# Altium schematic sheet [4] F2838 JTAG CLOCK SUP.SchDoc
size 431 x 279 mm; DocumentNumber: 5; SheetNumber: 5; SheetTotal: 9
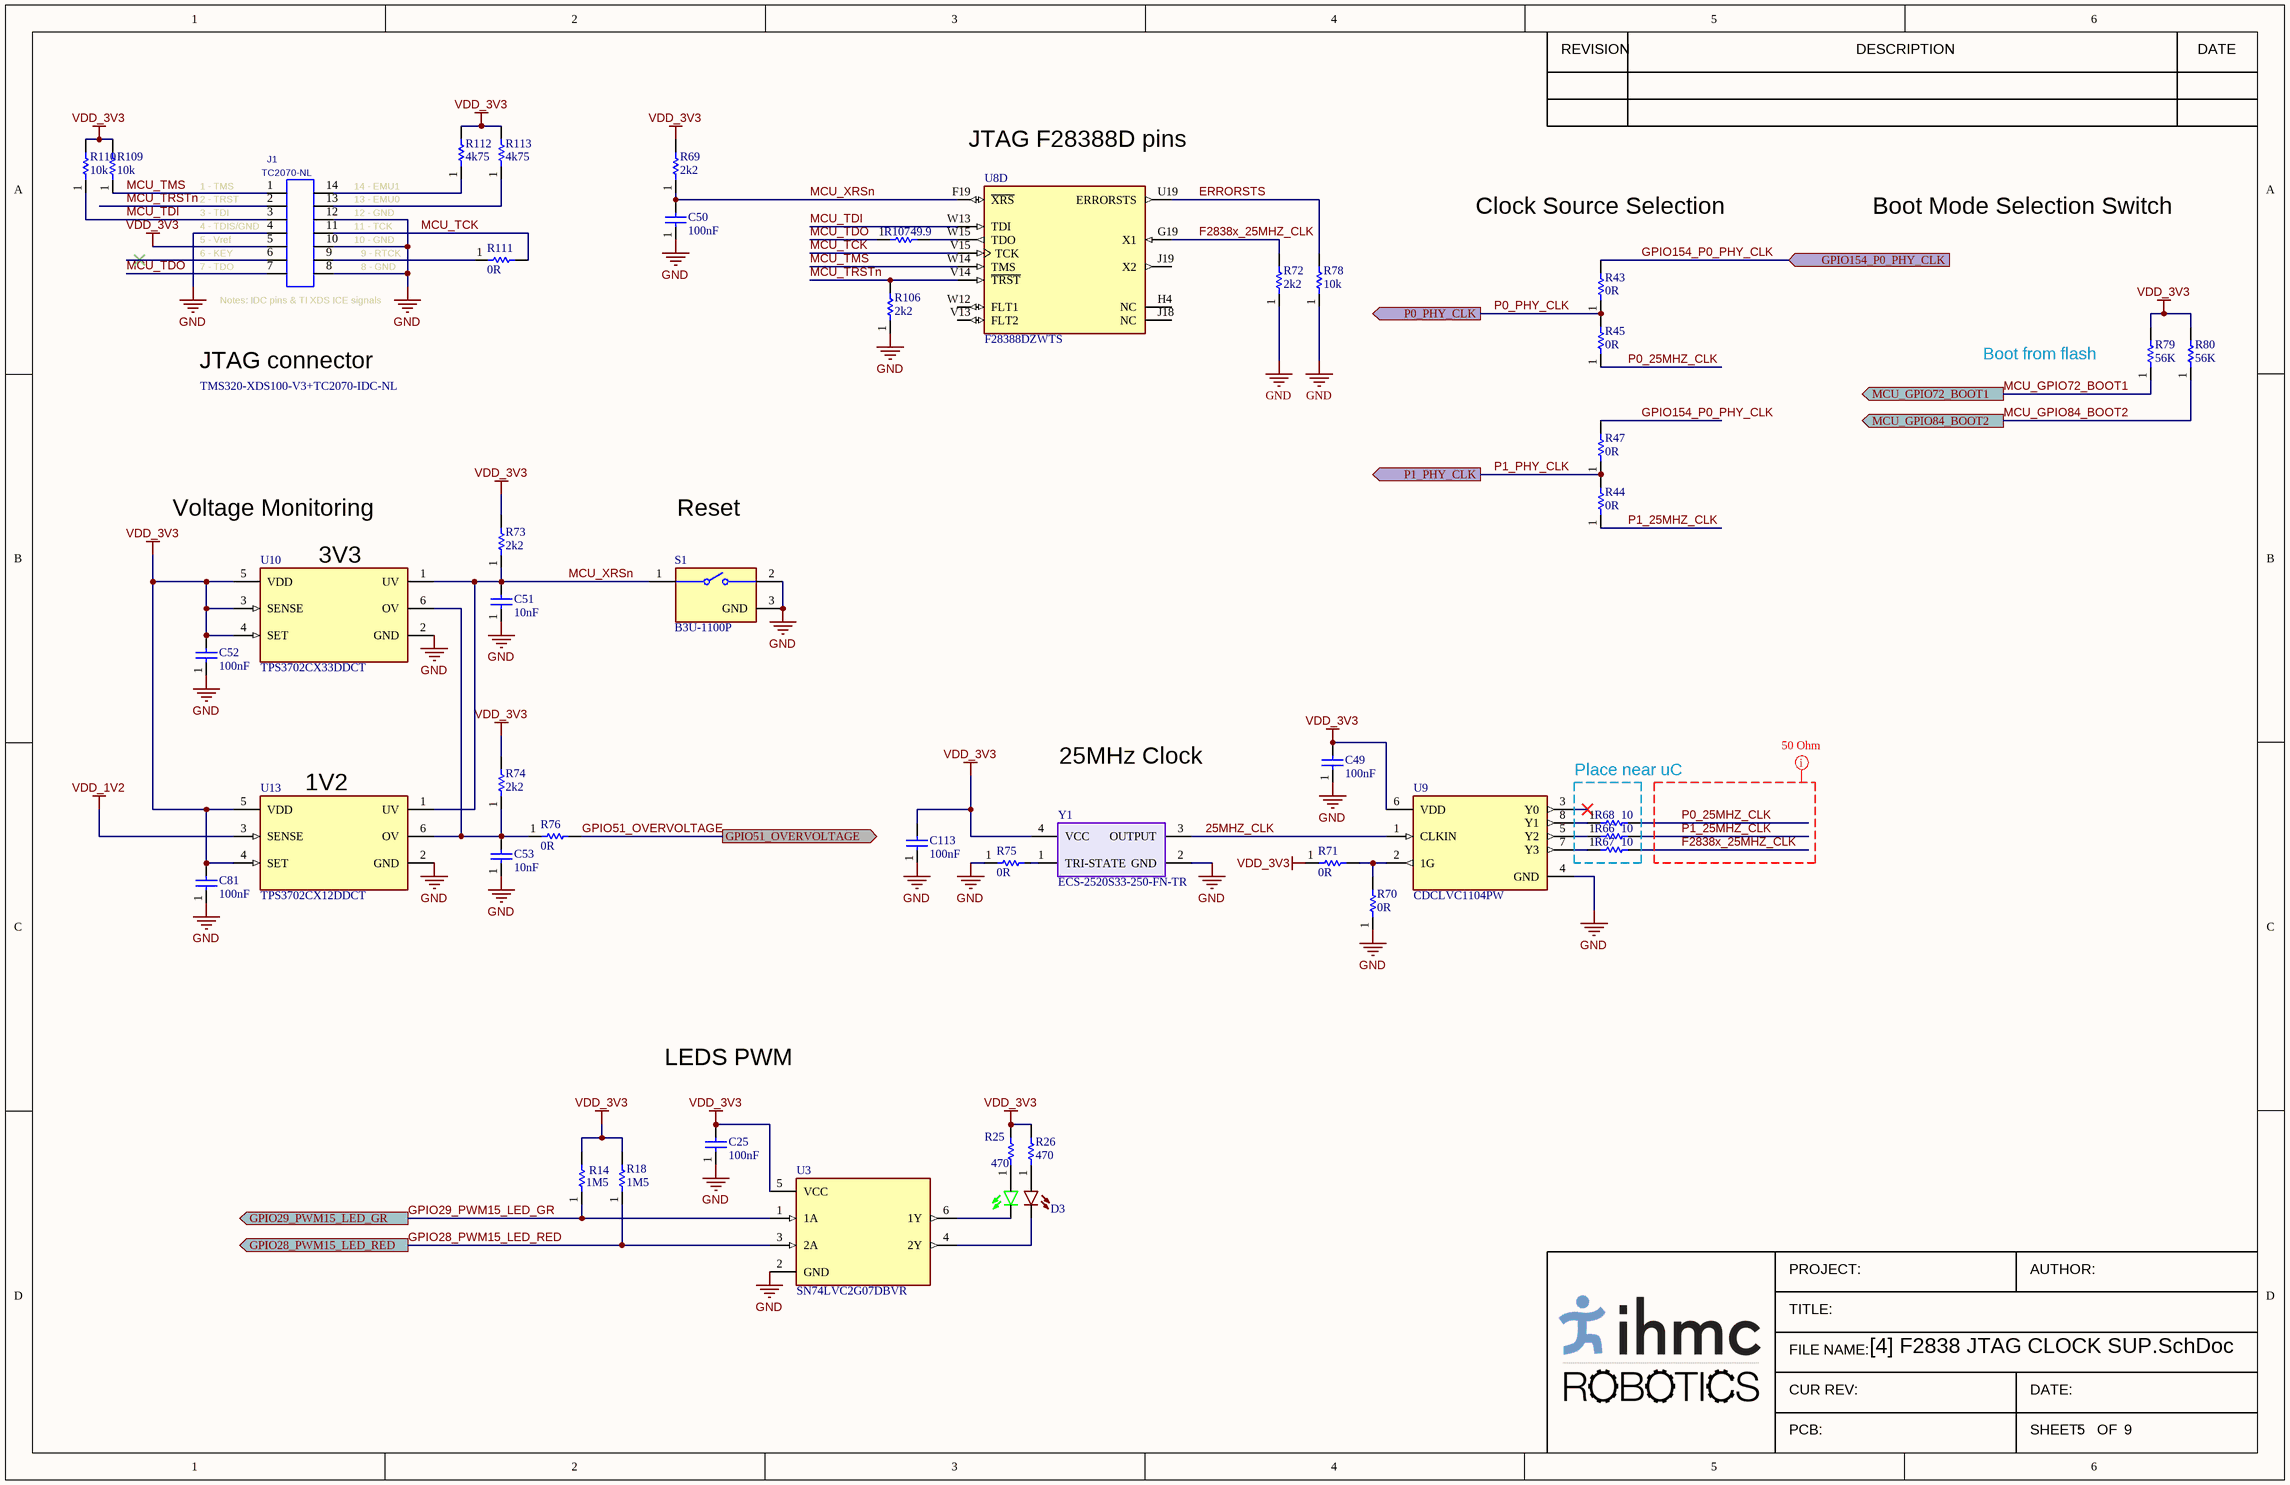
[diagram p0: [4] F2838 JTAG CLOCK SUP.SchDoc]

## Parts
C25  value 100nF  [CAPC1005X03N(0402)]  (hidden comment: GRM155R71C104JA88D)
C49  value 100nF  [CAPC1005X03N(0402)]  (hidden comment: GRM155R71C104JA88D)
C50  value 100nF  [CAPC1005X03N(0402)]  (hidden comment: GRM155R71C104JA88D)
C51  value 10nF  [CAPC1005X03N(0402)]  (hidden comment: CC0402KRX7R9BB103)
C52  value 100nF  [CAPC1005X03N(0402)]  (hidden comment: GRM155R71C104JA88D)
C53  value 10nF  [CAPC1005X03N(0402)]  (hidden comment: CC0402KRX7R9BB103)
C81  value 100nF  [CAPC1608X09N(0603)]  (hidden comment: CL10B104KB8NNNL)
C113  value 100nF  [CAPC1005X03N(0402)]  (hidden comment: GRM155R71C104JA88D)
D3  LTST-C195KGJRKT  [Dual_LED]  (value not drawn)
J1  TC2070-NL  [TC2070-NL]  (no BOM)
R14  value 1M5  [0402]  (hidden comment: CRCW04021M50JNED)
R18  value 1M5  [0402]  (hidden comment: CRCW04021M50JNED)
R25  value 470  [0402]  (hidden comment: CRCW0402470RJNED)
R26  value 470  [0402]  (hidden comment: CRCW0402470RJNED)
R43  value 0R  [0402]  (hidden comment: RCS04020000Z0ED)
R44  value 0R  [0402]  (hidden comment: RCS04020000Z0ED)
R45  value 0R  [0402]  (hidden comment: RCS04020000Z0ED)
R47  value 0R  [0402]  (hidden comment: RCS04020000Z0ED)
R66  value 10  [0402]  (hidden comment: ERA-2AKD100X)
R67  value 10  [0402]  (hidden comment: ERA-2AKD100X)
R68  value 10  [0402]  (hidden comment: ERA-2AKD100X)
R69  value 2k2  [0402]  (hidden comment: CRCW04022K20JNED)
R70  value 0R  [0402]  (hidden comment: RCS04020000Z0ED)
R71  value 0R  [0402]  (hidden comment: RCS04020000Z0ED)
R72  value 2k2  [0402]  (hidden comment: CRCW04022K20JNED)
R73  value 2k2  [0402]  (hidden comment: CRCW04022K20JNED)
R74  value 2k2  [0402]  (hidden comment: CRCW04022K20JNED)
R75  value 0R  [0402]  (hidden comment: RCS04020000Z0ED)
R76  value 0R  [0402]  (hidden comment: RCS04020000Z0ED)
R78  value 10k  [RESC1005X06N(0402)]  (hidden comment: RC0402FR-0710KL)
R79  value 56K  [0402]  (hidden comment: CRCW040256K0JNED)
R80  value 56K  [0402]  (hidden comment: CRCW040256K0JNED)
R106  value 2k2  [0402]  (hidden comment: CRCW04022K20JNED)
R107  value 49.9  [RESC1005X06N(0402)]  (hidden comment: CRCW040249R9FKED)
R109  value 10k  [RESC1005X06N(0402)]  (hidden comment: RC0402FR-0710KL)
R110  value 10k  [RESC1005X06N(0402)]  (hidden comment: RC0402FR-0710KL)
R111  value 0R  [0402]  (hidden comment: RCS04020000Z0ED)
R112  value 4k75  [RESC1005X06N(0402)]  (hidden comment: RC0402FR-074K75L)
R113  value 4k75  [RESC1005X06N(0402)]  (hidden comment: RC0402FR-074K75L)
S1  B3U-1100P  [FP-B3U-1100P-MFSWITCH_G]
U3  SN74LVC2G07DBVR  [DBV0006A_M]
U8  F28388DZWTS  [FP-ZWT0337A-IPC_B - ESNACK]  (part D of 8)
U9  CDCLVC1104PW  [FP-PW0008A-IPC_C-FIXONSHAPE]
U10  TPS3702CX33DDCT  [FP-DDC0006A-IPC_A]
U13  TPS3702CX12DDCT  [FP-DDC0006A-IPC_A]
Y1  ECS-2520S33-250-FN-TR  [XTAL_ECS-2520S]

## Ports
GPIO28_PWM15_LED_RED (out), GPIO29_PWM15_LED_GR (out), GPIO51_OVERVOLTAGE (out), GPIO154_P0_PHY_CLK (in), MCU_GPIO72_BOOT1 (out), MCU_GPIO84_BOOT2 (out), P0_PHY_CLK (out), P1_PHY_CLK (out)

## Nets
GND: C25.1 C49.1 C50.1 C51.1 C52.1 C53.1 C81.1 C113.1 J1.4 J1.8 J1.10 J1.12 R70.1 R72.1 R75.1 R78.1 R106.1 S1.2 S1.3(GND) U3.2(GND) U9.4(GND) U10.2(GND) U13.2(GND) Y1.2(GND)
VDD_1V2: U13.3(SENSE)
VDD_3V3: C25.2 C49.2 C52.2 C81.2 C113.2 J1.5 R14.2 R18.2 R25.2 R26.2 R69.2 R71.1 R73.2 R74.2 R79.2 R80.2 R109.2 R110.2 R112.2 R113.2 U3.5(VCC) U9.6(VDD) U10.3(SENSE) U10.4(SET) U10.5(VDD) U13.4(SET) U13.5(VDD) Y1.4(VCC)
25MHZ_CLK: U9.1(CLKIN) Y1.3(OUTPUT)
ERRORSTS: R78.2 U8.U19(ERRORSTS)
F2838x_25MHZ_CLK: R67.2 R72.2 U8.G19(X1)
GPIO28_PWM15_LED_RED: R18.1 U3.3(2A) ; port GPIO28_PWM15_LED_RED
GPIO29_PWM15_LED_GR: R14.1 U3.1(1A) ; port GPIO29_PWM15_LED_GR
GPIO51_OVERVOLTAGE: R76.2 ; port GPIO51_OVERVOLTAGE
GPIO154_P0_PHY_CLK: R43.2 R47.2 ; port GPIO154_P0_PHY_CLK
MCU_GPIO72_BOOT1: R79.1 ; port MCU_GPIO72_BOOT1
MCU_GPIO84_BOOT2: R80.1 ; port MCU_GPIO84_BOOT2
MCU_TCK: J1.11 R111.2 U8.V15(TCK)
MCU_TDI: J1.3 R110.1 U8.W13(TDI)
MCU_TDO: J1.7 R107.1
MCU_TMS: J1.1 R109.1 U8.W14(TMS)
MCU_TRSTn: J1.2 R106.2 U8.V14(~{TRST})
MCU_XRSn: C50.2 C51.2 R69.1 R73.1 S1.1 U8.F19(~{XRS}) U10.1(UV) U13.1(UV)
P0_25MHZ_CLK: R45.1 R68.2
P0_PHY_CLK: R43.1 R45.2 ; port P0_PHY_CLK
P1_25MHZ_CLK: R44.1 R66.2
P1_PHY_CLK: R44.2 R47.1 ; port P1_PHY_CLK
NetC53_2: C53.2 R74.1 R76.1 U10.6(OV) U13.6(OV)
NetD3_1: D3.1 R25.1
NetD3_2: D3.2 R26.1
NetD3_3: D3.3 U3.6(1Y)
NetD3_4: D3.4 U3.4(2Y)
NetJ1_9: J1.9 R111.1
NetJ1_13: J1.13 R113.1
NetJ1_14: J1.14 R112.1
NetR66_1: R66.1 U9.5(Y2)
NetR67_1: R67.1 U9.7(Y3)
NetR68_1: R68.1 U9.8(Y1)
NetR70_2: R70.2 R71.2 U9.2(1G)
NetR75_2: R75.2 Y1.1(TRI-STATE)
NetR107_2: R107.2 U8.W15(TDO)

Not connected (* = marked no-connect by the designer): J1 6*; U8 H4(NC) J18(NC) J19(X2) V13(FLT2) W12(FLT1); U9 3(Y0)*

## Layout directives
50 Ohm Impedance: Undefined: F2838x_25MHZ_CLK, P0_25MHZ_CLK, P1_25MHZ_CLK

## Notes on the sheet
- (near U8) JTAG F28388D pins
- Clock Source Selection
- Boot Mode Selection Switch
- JTAG connector
- (near R79) Boot from flash
- TMS320-XDS100-V3+TC2070-IDC-NL
- Voltage Monitoring
- (near U10) 3V3
- Reset
- 25MHz Clock
- Place near uC
- (near U13) 1V2
- LEDS PWM
- REVISION
- DESCRIPTION
- DATE
- PROJECT:
- AUTHOR:
- TITLE:
- FILE NAME:
- CUR REV:
- PCB:
- SHEET:
- DATE:
- OF
- (in symbol HDR 14 TC2070-NL) 1 - TMS; 14 - EMU1; 2 - TRST; 13 - EMU0; 3 - TDI; 12 - GND; 4 - TDIS/GND; 11 - TCK; 5 - Vref; 10 - GND; 6 - KEY; 9 - RTCK; 7 - TDO; 8 - GND; Notes: IDC pins & TI XDS ICE signals

## Library data of the parts
C25 C49 C50 C52 C113 = 100nF_16V_0402_CAP: CAP CER 0.1UF 16V X7R 0402; Tolerance: 5%; MPN: GRM155R71C104JA88D; Voltage Rating: 16V; Temp Coeff: X7R; Size/Package: 0402
C51 C53 = 10nF_50V_0402_CAP: CAP CER 10000PF 50V X7R 0402; Tolerance: 10%; MPN: CC0402KRX7R9BB103; Voltage: 50V; Temp Coeff: X7R; Size/Package: 0402; Supplier 1: Digi-Key; Supplier Part Number 1: 311-1349-1-ND
C81 = 100nF_50V_0603_CAP: CAP CER 0.1UF 50V X7R 0603; Tolerance: 105; MPN: CL10B104KB8NNNL; Temp Coeff: X7R; Voltage: 50V; Package/Case: 0603
D3 = Green/Red_LED: LED GREEN/RED CLEAR CHIP SMD; Color: Green, Red; Voltage Vf: 2V Green, 2V Red; Current If: 20mA. 20mA; MPN: LTST-C195KGJRKT; Mounting Type: SMD; Supplier 1: Digi-Key; Supplier Part Number 1: 160-1452-1-ND
J1 = HDR 14 TC2070-NL: HDR, TC2070, 14 Pin, Footprint only; Mfg-1: Tag-Connect; Mfg-1-P/N: TC2070-IDC-NL; Value: TC2070-NL
R14 R18 = 1M5_1/16W_0402_CRCW04021M50JNED_RES: RES SMD 1.5M OHM 5% 1/16W 0402; Manufacturer: Vishay Dale; Resistance: 1.5MR; Power Rating: 63mW; Voltage Rating: 50V; Temperature Coefficient: 200ppm/°C; Supplier 1: Digi-Key; Manufacturer Part Number: CRCW04021M50JNED; RoHS: Yes; Category: Chip SMD Resistors; Stock 1: 7870; Pricing 1: 1=0,10000, 10=0,03300, 100=0,01360, 1000=0,00610, 2500=0,00529, 5000=0,00437 (USD); Case/Package: 0402; Weight: 2.3E-05oz; Case Code (Imperial): 0402; Case Code (Metric): 1005; Contact Plating: Tin; Min Operating Temperature: -55°C; Max Operating Temperature: 155°C; Tolerance: 5%; Package Quantity: 1; Packaging: Tape and Reel; Termination: SMD/SMT; Resistor Type: Thick Film; Number of Terminations: 2; Max Power Dissipation: 63mW; Voltage Rating (DC): 50V; Features: Automotive AEC-Q200; Series: CRCW; Construction: Rectangular; Length: 1mm; Width: 0.5mm; Height: 0.016inch; Depth: 0.5mm; Radiation Hardening: No; RoHS Compliant: Yes; Military Standard: Not; Lead Free: Lead Free; ComponentLink1URL: https://datasheet.ciiva.com/9100/dcrcwe3-9100251.pdf?src-supplier=Avnet; ComponentLink1Description: https://datasheet.ciiva.com/9100/dcrcwe3-9100251.pdf?src-supplier=Avnet; ComponentLink2URL: https://datasheet.ciiva.com/2493/dcrcwe3-2493529.pdf?src-supplier=Digi-Key; ComponentLink2Description: https://datasheet.ciiva.com/2493/dcrcwe3-2493529.pdf?src-supplier=Digi-Key; ComponentLink3URL: https://datasheet.ciiva.com/2493/dcrcwe3-2493530.pdf?src-supplier=Digi-Key; ComponentLink3Description: https://datasheet.ciiva.com/2493/dcrcwe3-2493530.pdf?src-supplier=Digi-Key; ComponentLink4URL: https://datasheet.ciiva.com/2493/dcrcwe3-2493531.pdf?src-supplier=Digi-Key; ComponentLink4Description: https://datasheet.ciiva.com/2493/dcrcwe3-2493531.pdf?src-supplier=Digi-Key; Supplier Part Number 1: 541-1.5MJCT-ND
R25 R26 = 470_1/10W_0402_CRCW0402470RJNED: Vishay CRCW Series Thick Film Resistor 0402 Case 470 5% 0.063W 200ppm/K; Manufacturer: Vishay Dale; Resistance: 470R; Max Power Dissipation: 63mW; Temperature Coefficient: 200ppm/°C; Voltage Rating: 50V; Supplier 1: Digi-Key; Manufacturer Part Number: CRCW0402470RJNED; RoHS: Yes; Category: Chip SMD Resistors; Pricing 1: 1=0,10000, 10=0,03300, 100=0,01360, 1000=0,00610, 2500=0,00529, 5000=0,00437 (USD); Case/Package: 0402; Number of Pins: 2; Weight: 2.3E-05oz; Case Code (Metric): 1005; Case Code (Imperial): 0402; Contact Plating: Tin; Min Operating Temperature: -55°C; Max Operating Temperature: 155°C; Packaging: Tape and Reel; Tolerance: 5%; Package Quantity: 1; Resistor Type: Thick Film; Number of Terminations: 2; Features: Automotive AEC-Q200; Power Rating: 63mW; Termination: SMD/SMT; Series: CRCW; Voltage Rating (DC): 50V; Resistance Tolerance: 5%; Construction: Rectangular; Technology: THICK FILM; Length: 1mm; Width: 0.02inch; Height: 0.35mm; Depth: 0.5mm; Radiation Hardening: No; RoHS Compliant: Yes; Lead Free: Lead Free; Military Standard: Not; REACH SVHC: Unknown; ComponentLink1URL: https://datasheet.ciiva.com/2461/dcrcwe3-2461992.pdf?src-supplier=Digi-Key; ComponentLink1Description: https://datasheet.ciiva.com/2461/dcrcwe3-2461992.pdf?src-supplier=Digi-Key; ComponentLink2URL: https://datasheet.ciiva.com/2461/dcrcwe3-2461993.pdf?src-supplier=Digi-Key; ComponentLink2Description: https://datasheet.ciiva.com/2461/dcrcwe3-2461993.pdf?src-supplier=Digi-Key; ComponentLink3URL: https://datasheet.ciiva.com/2461/dcrcwe3-2461994.pdf?src-supplier=Digi-Key; ComponentLink3Description: https://datasheet.ciiva.com/2461/dcrcwe3-2461994.pdf?src-supplier=Digi-Key; ComponentLink4URL: https://datasheet.ciiva.com/5550/dcrcwe3-109170-5550440.pdf?src-supplier=Mouser; ComponentLink4Description: https://datasheet.ciiva.com/5550/dcrcwe3-109170-5550440.pdf?src-supplier=Mouser; ComponentLink5URL: https://datasheet.ciiva.com/3256/dcrcwe3-3256554.pdf?src-supplier=Avnet; ComponentLink5Description: https://datasheet.ciiva.com/3256/dcrcwe3-3256554.pdf?src-supplier=Avnet; ComponentLink6URL: https://datasheet.ciiva.com/8336/dcrcwe3-8336717.pdf?src-supplier=Avnet; ComponentLink6Description: https://datasheet.ciiva.com/8336/dcrcwe3-8336717.pdf?src-supplier=Avnet; ComponentLink7URL: https://datasheet.ciiva.com/28571/1847332-28571880.pdf?src-supplier=Element14; ComponentLink7Description: https://datasheet.ciiva.com/28571/1847332-28571880.pdf?src-supplier=Element14; Supplier Part Number 1: 541-470JDKR-ND
R43-R45 R47 R70 R71 R75 R76 R111 = 0R_1/5W_0402_RCS04020000Z0ED_RES: VISHAY - RCS04020000Z0ED - SMD Chip Resistor, 0402 [1005 Metric], 0 ohm, RCS Series, 50 V, Thick Film, 200 mW; Manufacturer: Vishay Dale; Resistance: 0mR; Max Power Dissipation: 200mW; Supplier 1: Digi-Key; Manufacturer Part Number: RCS04020000Z0ED; RoHS: Yes; Category: Chip SMD Resistors; Stock 1: 18214; Pricing 1: 1=0.10000, 10=0.08300, 25=0.05760, 50=0.04480, 100=0.03200, 250=0.02496, 500=0.01984, 1000=0.01408, 5000=0.01088 (USD); Case/Package: 0402; Case Code (Metric): 1005; Case Code (Imperial): 0402; Min Operating Temperature: -55°C; Max Operating Temperature: 155°C; Packaging: Tape and Reel; Resistor Type: Thick Film; Number of Terminations: 2; Features: Automotive AEC-Q200; Length: 0.039inch; Width: 0.02inch; Height: 0.016inch; RoHS Compliant: Yes; ComponentLink1URL: http://www.farnell.com/datasheets/2618474.pdf?src-supplier=Farnell; ComponentLink1Description: http://www.farnell.com/datasheets/2618474.pdf?src-supplier=Farnell; ComponentLink2URL: http://www.vishay.com/docs/20065/rcse3.pdf?src-supplier=Digi-Key; ComponentLink2Description: http://www.vishay.com/docs/20065/rcse3.pdf?src-supplier=Digi-Key; ComponentLink3URL: http://www.farnell.com/datasheets/2618474.pdf?src-supplier=Element14; ComponentLink3Description: http://www.farnell.com/datasheets/2618474.pdf?src-supplier=Element14; ComponentLink4URL: http://www.farnell.com/datasheets/2618474.pdf?src-supplier=Newark; ComponentLink4Description: http://www.farnell.com/datasheets/2618474.pdf?src-supplier=Newark; Supplier Part Number 1: 541-2877-1-ND
R66-R68 = 10R_0402_0.5%_ERA-2AKD100X: Res Thin Film 0402 10 Ohm 0.5% 1/16W 100ppm/C Molded SMD SMD Punched Carrier T/R; Manufacturer: Panasonic; Resistance: 10R; Power Rating: 63mW; Voltage Rating: 25V; Temperature Coefficient: 100ppm/°C; Supplier 1: Digi-Key; Manufacturer Part Number: ERA-2AKD100X; RoHS: Yes; Category: Chip SMD Resistors; Stock 1: 304; Pricing 1: 1=0.10000, 10=0.06500, 100=0.02660, 1000=0.01192, 2500=0.01035, 5000=0.00855 (USD); Mount: Surface Mount; Case/Package: 0402; Case Code (Metric): 1005; Case Code (Imperial): 0402; Contact Plating: Tin; Min Operating Temperature: -55°C; Max Operating Temperature: 155°C; Packaging: Tape and Reel; Tolerance: 0.5%; Package Quantity: 10000; Resistor Type: Thin Film,Metal Film; Number of Terminations: 2; Max Power Dissipation: 63mW; Series: ERA-2A; Construction: Rectangular; Length: 1mm; Width: 0.02inch; Height: 0.016inch; Depth: 0.5mm; Radiation Hardening: No; Military Standard: Not; Lead Free: Lead Free; RoHS Compliant: Yes; ComponentLink1URL: https://datasheet.ciiva.com/9117/aoa0000ce26-9117292.pdf?src-supplier=Avnet; ComponentLink1Description: https://datasheet.ciiva.com/9117/aoa0000ce26-9117292.pdf?src-supplier=Avnet; ComponentLink2URL: https://datasheet.ciiva.com/24026/aoa0000ce26-32660-24026776.pdf?src-supplier=Mouser; ComponentLink2Description: https://datasheet.ciiva.com/24026/aoa0000ce26-32660-24026776.pdf?src-supplier=Mouser; ComponentLink3URL: https://datasheet.ciiva.com/30256/54aoa0000ce26-30256601.pdf?src-supplier=Onlinecomponents.com; ComponentLink3Description: https://datasheet.ciiva.com/30256/54aoa0000ce26-30256601.pdf?src-supplier=Onlinecomponents.com; Supplier Part Number 1: P10DDCT-ND
R69 R72-R74 R106 = 2k2_1/16_0402_CRCW04022K20JNED_RES: Vishay CRCW Series Thick Film Resistor 0402 Case 2.2k 5% 0.063W 200ppm/K; Manufacturer: Vishay Dale; Resistance: 2.2kR; Temperature Coefficient: 200ppm/°C; Max Power Dissipation: 63mW; Voltage Rating: 50V; Supplier 1: Digi-Key; Manufacturer Part Number: CRCW04022K20JNED; RoHS: Yes; Category: Chip SMD Resistors; Stock 1: 5003; Pricing 1: 1=0,10000, 10=0,03300, 100=0,01360, 1000=0,00610, 2500=0,00529, 5000=0,00437 (USD); Mount: Surface Mount; Case/Package: 0402; Case Code (Imperial): 0402; Case Code (Metric): 1005; Contact Plating: Tin; Weight: 2.3E-05oz; Size Code: 0402; Min Operating Temperature: -55°C; Max Operating Temperature: 155°C; Tolerance: 5%; Resistor Type: Thick Film; Packaging: Tape and Reel; Number of Terminations: 2; Power Rating: 63mW; Package Quantity: 1; Features: Automotive AEC-Q200; Termination: SMD/SMT; Voltage Rating (DC): 50V; Series: CRCW; Resistance Tolerance: 5%; Construction: Rectangular; Technology: THICK FILM; Length: 1mm; Width: 0.5mm; Height: 0.35mm; Depth: 0.5mm; Radiation Hardening: No; RoHS Compliant: Yes; Lead Free: Lead Free; REACH SVHC: Unknown; Military Standard: Not; ComponentLink1URL: https://datasheet.ciiva.com/5542/dcrcwe3-109170-5542006.pdf?src-supplier=Mouser; ComponentLink1Description: https://datasheet.ciiva.com/5542/dcrcwe3-109170-5542006.pdf?src-supplier=Mouser; ComponentLink2URL: https://datasheet.ciiva.com/3256/dcrcwe3-3256342.pdf?src-supplier=Avnet; ComponentLink2Description: https://datasheet.ciiva.com/3256/dcrcwe3-3256342.pdf?src-supplier=Avnet; ComponentLink3URL: https://datasheet.ciiva.com/3256/dcrcwe3-3256343.pdf?src-supplier=Avnet; ComponentLink3Description: https://datasheet.ciiva.com/3256/dcrcwe3-3256343.pdf?src-supplier=Avnet; ComponentLink4URL: https://datasheet.ciiva.com/2462/dcrcwe3-2462040.pdf?src-supplier=Digi-Key; ComponentLink4Description: https://datasheet.ciiva.com/2462/dcrcwe3-2462040.pdf?src-supplier=Digi-Key; ComponentLink5URL: https://datasheet.ciiva.com/2462/dcrcwe3-2462041.pdf?src-supplier=Digi-Key; ComponentLink5Description: https://datasheet.ciiva.com/2462/dcrcwe3-2462041.pdf?src-supplier=Digi-Key; ComponentLink6URL: https://datasheet.ciiva.com/2462/dcrcwe3-2462042.pdf?src-supplier=Digi-Key; ComponentLink6Description: https://datasheet.ciiva.com/2462/dcrcwe3-2462042.pdf?src-supplier=Digi-Key; ComponentLink7URL: https://datasheet.ciiva.com/16760/70201119-16760139.pdf?src-supplier=Allied+Electronics; ComponentLink7Description: https://datasheet.ciiva.com/16760/70201119-16760139.pdf?src-supplier=Allied+Electronics; ComponentLink8URL: https://datasheet.ciiva.com/16436/dcrcwe3-16436154.pdf?src-supplier=Future+Electronics; ComponentLink8Description: https://datasheet.ciiva.com/16436/dcrcwe3-16436154.pdf?src-supplier=Future+Electronics; ComponentLink9URL: https://datasheet.ciiva.com/7743/dcrcwe3-7743566.pdf?src-supplier=Element14; ComponentLink9Description: https://datasheet.ciiva.com/7743/dcrcwe3-7743566.pdf?src-supplier=Element14; Supplier Part Number 1: 541-2.2KJCT-ND
R78 R109 R110 = 10k_1/16W_0402_RES: RES SMD 10K OHM 1% 1/16W 0402; Tolerance: 1%; Power: 1/16W; Size: 0402; MPN: RC0402FR-0710KL
R79 R80 = 56K_5%_0402_CRCW040256K0JNED_RES: Res Thick Film 0402 56K Ohm 5% 0.063W(1/16W) ±200ppm/C Pad SMD Automotive T/R; Manufacturer: Vishay Dale; Resistance: 56kR; Power Rating: 63mW; Temperature Coefficient: 200ppm/°C; Voltage Rating: 50V; Supplier 1: Digi-Key; Manufacturer Part Number: CRCW040256K0JNED; RoHS: Yes; Category: Chip SMD Resistors; Pricing 1: 1=0.10000, 10=0.03300, 100=0.01360, 1000=0.00610, 2500=0.00529, 5000=0.00437 (USD); Case/Package: 0402; Number of Pins: 2; Weight: 2.3E-05oz; Case Code (Imperial): 0402; Case Code (Metric): 1005; Contact Plating: Tin; Size Code: 0402; Min Operating Temperature: -55°C; Max Operating Temperature: 155°C; Packaging: Tape and Reel; Tolerance: 5%; Resistor Type: Thick Film; Package Quantity: 1; Number of Terminations: 2; Max Power Dissipation: 63mW; Features: Automotive AEC-Q200; Series: CRCW; Termination: Solder; Voltage Rating (DC): 50V; Construction: Rectangular; Technology: THICK FILM; Resistance Tolerance: 5%; Length: 1mm; Width: 0.5mm; Height: 0.35mm; Depth: 0.5mm; Radiation Hardening: No; Lead Free: Lead Free; RoHS Compliant: Yes; Military Standard: Not; REACH SVHC: Unknown; ComponentLink1URL: https://datasheet.ciiva.com/2493/dcrcwe3-2493667.pdf?src-supplier=Digi-Key; ComponentLink1Description: https://datasheet.ciiva.com/2493/dcrcwe3-2493667.pdf?src-supplier=Digi-Key; ComponentLink2URL: https://datasheet.ciiva.com/2493/dcrcwe3-2493668.pdf?src-supplier=Digi-Key; ComponentLink2Description: https://datasheet.ciiva.com/2493/dcrcwe3-2493668.pdf?src-supplier=Digi-Key; ComponentLink3URL: https://datasheet.ciiva.com/2493/dcrcwe3-2493669.pdf?src-supplier=Digi-Key; ComponentLink3Description: https://datasheet.ciiva.com/2493/dcrcwe3-2493669.pdf?src-supplier=Digi-Key; ComponentLink4URL: https://datasheet.ciiva.com/16436/dcrcwe3-16436121.pdf?src-supplier=Future+Electronics; ComponentLink4Description: https://datasheet.ciiva.com/16436/dcrcwe3-16436121.pdf?src-supplier=Future+Electronics; ComponentLink5URL: https://datasheet.ciiva.com/16768/70201119-16768810.pdf?src-supplier=Allied+Electronics; ComponentLink5Description: https://datasheet.ciiva.com/16768/70201119-16768810.pdf?src-supplier=Allied+Electronics; Supplier Part Number 1: 541-56KJCT-ND
R107 = 49R9_1/10W_0402_RES: RES SMD 49.9 OHM 1% 1/16W 0402; MPN: CRCW040249R9FKED; Wattage: 1/16W; Drawn By: TC; Tolerance: 1%; Supplier 1: Digi-Key; Supplier Part Number 1: 541-49.9LCT-ND
R112 R113 = 4k75_1/16_0402_RES: RES SMD 4.75K OHM 1% 1/16W 0402; Power: 1/16; MPN: RC0402FR-074K75L; Tolerance: 1%; Package/Case: 0402
S1 = SWITCH_SPST_NO_B3U-1100P: Switch Tactile N.O. SPST Round Button Gull Wing 0.05A 12VDC 1.5N SMD Embossed T/R; Manufacturer: Omron; Mechanical Life: 200000Cycles; Voltage Rating (DC): 12V; Contact Resistance: 100mR; Current Rating: 50mA; Illumination Type: Non-Illuminated,Illuminated; Switch Travel: 0.15mm; Switch Function: Off-Mom; Actuator Type: Standard; Actuator Length: 0.4mm; Ratings: Dust Proof; Supplier 1: Digi-Key; Manufacturer Part Number: B3U-1100P; RoHS: Yes; Category: Tactile Switches; Pricing 1: 1=0.96000, 10=0.92700, 25=0.86640, 100=0.75220, 250=0.68448, 500=0.63456, 1000=0.62388 (USD); Mount: Surface Mount; Weight: 0.022g; Contact Plating: Silver; Min Operating Temperature: -25°C; Max Operating Temperature: 70°C; Operating Force: 1.5N; Throw Configuration: SPST; Packaging: Tape and Reel; Max Voltage Rating (DC): 12V; Package Quantity: 1; Electrical Life: 200000Cycles; Orientation: Straight; Series: B3U; Termination: SMD/SMT; Max Current Rating: 50mA; Contact Current Rating: 50mA; Length: 3.15mm; Depth: 4mm; RoHS Compliant: Yes; REACH SVHC: Unknown; Lead Free: Lead Free; ComponentLink1URL: https://datasheet.ciiva.com/1634/60838-1634404.pdf?src-supplier=Farnell; ComponentLink1Description: https://datasheet.ciiva.com/1634/60838-1634404.pdf?src-supplier=Farnell; ComponentLink2URL: https://datasheet.ciiva.com/2901/b3u-1110-2901097.pdf?src-supplier=Digi-Key; ComponentLink2Description: https://datasheet.ciiva.com/2901/b3u-1110-2901097.pdf?src-supplier=Digi-Key; ComponentLink3URL: https://datasheet.ciiva.com/2901/b3u-1110-2901098.pdf?src-supplier=Digi-Key; ComponentLink3Description: https://datasheet.ciiva.com/2901/b3u-1110-2901098.pdf?src-supplier=Digi-Key; ComponentLink4URL: https://datasheet.ciiva.com/2901/b3u-1110-2901099.pdf?src-supplier=Digi-Key; ComponentLink4Description: https://datasheet.ciiva.com/2901/b3u-1110-2901099.pdf?src-supplier=Digi-Key; ComponentLink5URL: https://datasheet.ciiva.com/30197/en-b3u-30197271.pdf?src-supplier=Onlinecomponents.com; ComponentLink5Description: https://datasheet.ciiva.com/30197/en-b3u-30197271.pdf?src-supplier=Onlinecomponents.com; ComponentLink6URL: https://datasheet.ciiva.com/16155/en-b3u-16155023.pdf?src-supplier=Onlinecomponents.com; ComponentLink6Description: https://datasheet.ciiva.com/16155/en-b3u-16155023.pdf?src-supplier=Onlinecomponents.com; ComponentLink7URL: https://datasheet.ciiva.com/1532/60838-1532684.pdf?src-supplier=Element14; ComponentLink7Description: https://datasheet.ciiva.com/1532/60838-1532684.pdf?src-supplier=Element14; ComponentLink8URL: https://datasheet.ciiva.com/22696/60838-22696216.pdf?src-supplier=Element14; ComponentLink8Description: https://datasheet.ciiva.com/22696/60838-22696216.pdf?src-supplier=Element14; ComponentLink9URL: https://datasheet.ciiva.com/14142/b3u-eng-datasheet-14142541.pdf?src-supplier=Distrelec; ComponentLink9Description: https://datasheet.ciiva.com/14142/b3u-eng-datasheet-14142541.pdf?src-supplier=Distrelec; Supplier Part Number 1: SW1021CT-ND
U3 = BUF_NONINV_SN74LVC2G07DBVR_SOT23: Buffer/Driver 2-CH Non-Inverting Open Drain CMOS 6-Pin SOT-23 T/R; Manufacturer: Texas Instruments; Logic Function: Buffer,Inverting; Number of Inputs: 2; Max Supply Voltage: 5.5V; Min Supply Voltage: 1.65V; Propagation Delay: 8.6ns; Number of Bits per Element: 1; Low Level Output Current: 32mA; Quiescent Current: 10uA; Nominal Supply Current: 40mA; Supplier 1: Digi-Key; Manufacturer Part Number: SN74LVC2G07DBVR; RoHS: Yes; Category: Buffers, Drivers and Transceivers; Pricing 1: 1=0.41000, 10=0.32900, 25=0.30080, 100=0.22390, 250=0.20288, 500=0.16790, 1000=0.12593 (USD); Mount: Surface Mount; Case/Package: SOT-23; Number of Pins: 6; Contact Plating: Gold; Min Operating Temperature: -40°C; Max Operating Temperature: 125°C; Polarity: Non-Inverting; Number of Outputs: 2; Packaging: Tape and Reel; Package Quantity: 3000; Number of Elements: 2; Number of Channels: 2; Number of Input Lines: 2; Number of Output Lines: 2; Turn-On Delay Time: 8.6ns; Number of Gates: 2; Number of Bits: 2; High Level Output Current: 32mA; Termination: SMD/SMT; Number of Circuits: 2; Length: 2.9mm; Width: 1.6mm; Height: 1.15mm; Radiation Hardening: No; Lead Free: Lead Free; RoHS Compliant: Yes; REACH SVHC: No SVHC; ComponentLink1URL: https://datasheet.ciiva.com/7744/1768165-7744017.pdf?src-supplier=Element14; ComponentLink1Description: https://datasheet.ciiva.com/7744/1768165-7744017.pdf?src-supplier=Element14; ComponentLink2URL: https://datasheet.ciiva.com/15094/getdatasheetpartid-76852-15094553.pdf?src-supplier=Verical; ComponentLink2Description: https://datasheet.ciiva.com/15094/getdatasheetpartid-76852-15094553.pdf?src-supplier=Verical; ComponentLink3URL: https://datasheet.ciiva.com/26862/sn74lvc2g07dbvr-26862180.pdf?src-supplier=IIIC; ComponentLink3Description: https://datasheet.ciiva.com/26862/sn74lvc2g07dbvr-26862180.pdf?src-supplier=IIIC; ComponentLink4URL: https://datasheet.ciiva.com/46394/1882764-46394021.pdf?src-supplier=Element14; ComponentLink4Description: https://datasheet.ciiva.com/46394/1882764-46394021.pdf?src-supplier=Element14; ComponentLink5URL: https://datasheet.ciiva.com/46439/1856224-46439623.pdf?src-supplier=Element14; ComponentLink5Description: https://datasheet.ciiva.com/46439/1856224-46439623.pdf?src-supplier=Element14; ComponentLink6URL: https://datasheet.ciiva.com/1833/sn74lvc2g07-1833701.pdf?src-supplier=Digi-Key; ComponentLink6Description: https://datasheet.ciiva.com/1833/sn74lvc2g07-1833701.pdf?src-supplier=Digi-Key; ComponentLink7URL: https://datasheet.ciiva.com/1833/sn74lvc2g07-1833700.pdf?src-supplier=Digi-Key; ComponentLink7Description: https://datasheet.ciiva.com/1833/sn74lvc2g07-1833700.pdf?src-supplier=Digi-Key; ComponentLink8URL: https://datasheet.ciiva.com/1833/sn74lvc2g07-1833702.pdf?src-supplier=Digi-Key; ComponentLink8Description: https://datasheet.ciiva.com/1833/sn74lvc2g07-1833702.pdf?src-supplier=Digi-Key; ComponentLink9URL: https://datasheet.ciiva.com/26220/sn74lvc2g07-26220924.pdf?src-supplier=Avnet+Europe; ComponentLink9Description: https://datasheet.ciiva.com/26220/sn74lvc2g07-26220924.pdf?src-supplier=Avnet+Europe; ComponentLink10URL: https://datasheet.ciiva.com/48703/001074025-da-01-en-ic-buff-dvr-sn74lvc2g07dbvr-sot-23-6-tid-48703260.pdf?src-supplier=Conrad; ComponentLink10Description: https://datasheet.ciiva.com/48703/001074025-da-01-en-ic-buff-dvr-sn74lvc2g07dbvr-sot-23-6-tid-48703260.pdf?src-supplier=Conrad; Supplier Part Number 1: 296-13494-6-ND
U8 = TMS320F28388D_32bit_uC: 32-bit MCU with connectivity manager, 2x C28x+CLA CPU, 1.5 MB flash, FPU64, CLB, Ethernet, EtherCAT 337-NFBGA -40 to +125; Manufacturer: Texas instruments; Standoff Height: 0.35mm; Number Of Usb Channels: 1; Max Junction Temp: +125°C; Data Bus Width: 32bits; Number Of I/Os: 169; Number Of A/D Converters: 4; Number Of Cores: 2; Number Of Uart Channels: 5; Min Supply Voltage: 1.14V; Memory Size: 1.5MBytes; Interface: I2C,SPI,UART,EBI/EMI,CAN,USB,SCI,IrDA,Ethernet,I2S,SMBus,LVCMOS,Other; Number Of Timers/Counters: 6; Number Of Adc Channels: 24; Ram Size: 312KBytes; Max Supply Voltage: 3.47V; Frequency: 200MHz; Core Architecture: C28x; Number Of Pwm Channels: 32; Number Of I2C Channels: 3; Device Class L1: Integrated Circuits (ICs); Category: IC; ComponentLink2URL: http://www.ti.com/lit/ds/symlink/tms320f28388s.pdf; Number Of Ethernet Channels: 1; Memory Type: FLASH; Device Class L2: Embedded Processors and Controllers; ComponentLink2Description: Datasheet; Package: ZWT0337A; Temperature Range Low: -40°C; RoHS: TRUE; Lead Free: Yes; Device Class L3: Microcontrollers; Automotive: No; Height: 1.4mm; Ambient Temperature Range Low: -40°C; Ipc Land Pattern Name: BGA361N80P19X19_1600X1600X140; Number Of Spi Channels: 4; Ambient Temperature Range High: +125°C; Octopart: https://octopart.com/f28388dzwts-texas+instruments-102550657; Manufacturer Part Number: F28388DZWTS; Temperature Range High: +125°C; Temperature: -40°C to +125°C
U9 = BUF_CLOCK_CDCLVC1104PW: Clock Fanout Buffer 4-OUT 8-Pin TSSOP Tube; Manufacturer: Texas Instruments; Supply Current: 20mA; Turn-On Delay Time: 10ns; Number of Circuits: 1; Input: LVCMOS; Max Supply Voltage: 3.6V; Min Supply Voltage: 2.3V; Number of Outputs: 4; Max Supply Current: 10mA; Frequency: 250MHz; Propagation Delay: 2.6ns; Width: 3.1mm; Length: 4.5mm; Contact Plating: Gold; Number of Pins: 8; Case/Package: TSSOP; Packaging: Rail/Tube; Lead Free: Lead Free; Nominal Supply Current: 20mA; Height: 1.05mm; Series: CDCLVC1104; Max Operating Temperature: 85°C; Min Operating Temperature: -40°C; REACH SVHC: No SVHC; Package Quantity: 150; Radiation Hardening: No; Mount: Surface Mount; Max Frequency: 250MHz; Supplier 1: Digi-Key; Manufacturer Part Number: CDCLVC1104PW; RoHS: Yes; Category: Clock Buffers, Drivers; Pricing 1: 1=4,25000, 10=3,81400, 25=3,60600, 100=3,12530, 250=2,96504, 500=2,66052, 1000=2,64600 (USD); ComponentLink1URL: https://datasheet.ciiva.com/1138/1882153-1138761.pdf?src-supplier=Element14; ComponentLink1Description: https://datasheet.ciiva.com/1138/1882153-1138761.pdf?src-supplier=Element14; ComponentLink2URL: https://datasheet.ciiva.com/3307/cdclvc1110-3307277.pdf?src-supplier=Avnet; ComponentLink2Description: https://datasheet.ciiva.com/3307/cdclvc1110-3307277.pdf?src-supplier=Avnet; ComponentLink3URL: https://datasheet.ciiva.com/6677/cdclvc1102-6677017.pdf?src-supplier=Digi-Key; ComponentLink3Description: https://datasheet.ciiva.com/6677/cdclvc1102-6677017.pdf?src-supplier=Digi-Key; ComponentLink4URL: https://datasheet.ciiva.com/14150/cdclvc11xx-eng-ds-14150439.pdf?src-supplier=Distrelec; ComponentLink4Description: https://datasheet.ciiva.com/14150/cdclvc11xx-eng-ds-14150439.pdf?src-supplier=Distrelec; Supplier Part Number 1: 296-33170-5-ND
U10 = SUPERVISOR_3V3_TPS3702CX33DDCT_TSOT: Processor Supervisor 3.3V 1 Active Low/Open Drain 6-Pin TSOT-23 T/R; Manufacturer: Texas Instruments; Number of Voltages Monitored: 1; Min Supply Voltage: 2V; Max Supply Voltage: 18V; Accuracy: 0.25%; Operating Supply Current: 7uA; Overvoltage Threshold: 3.6V; Undervoltage Threshold: 3.17V; Quiescent Current: 6uA; Supplier 1: Digi-Key; Manufacturer Part Number: TPS3702CX33DDCT; RoHS: Yes; Category: Voltage Supervisors; Pricing 1: 1=2.89000, 10=2.59800, 25=2.45640, 100=2.12900 (USD); Mount: Surface Mount; Case/Package: SOT-6; Number of Pins: 6; Weight: 0.001058oz; Min Operating Temperature: -40°C; Max Operating Temperature: 125°C; Packaging: Tape and Reel; Reset: Active Low; Threshold Voltage: 3.3V; Number of Monitored Inputs: 1; Package Quantity: 250; Type: Voltage Detector; REACH SVHC: No SVHC; Lead Free: Lead Free; RoHS Compliant: Yes; ComponentLink1URL: http://www.ti.com/general/docs/lit/getliterature.tsp?genericPartNumber=TPS3702&&fileType=pdf&src-supplier=Farnell; ComponentLink1Description: http://www.ti.com/general/docs/lit/getliterature.tsp?genericPartNumber=TPS3702&&fileType=pdf&src-supplier=Farnell; ComponentLink2URL: http://www.ti.com/general/docs/lit/getliterature.tsp?genericPartNumber=TPS3702&amp;&amp;fileType=pdf&src-supplier=Farnell; ComponentLink2Description: http://www.ti.com/general/docs/lit/getliterature.tsp?genericPartNumber=TPS3702&amp;&amp;fileType=pdf&src-supplier=Farnell; ComponentLink3URL: http://www.ti.com/lit/ds/symlink/tps3702.pdf?src-supplier=Digi-Key; ComponentLink3Description: http://www.ti.com/lit/ds/symlink/tps3702.pdf?src-supplier=Digi-Key; ComponentLink4URL: http://www.ti.com/general/docs/lit/getliterature.tsp?genericPartNumber=TPS3702&&fileType=pdf&src-supplier=Avnet; ComponentLink4Description: http://www.ti.com/general/docs/lit/getliterature.tsp?genericPartNumber=TPS3702&&fileType=pdf&src-supplier=Avnet; ComponentLink5URL: http://www.ti.com/lit/gpn/tps3702?src-supplier=Mouser; ComponentLink5Description: http://www.ti.com/lit/gpn/tps3702?src-supplier=Mouser; ComponentLink6URL: http://www.ti.com/general/docs/lit/getliterature.tsp?genericPartNumber=TPS3702&&fileType=pdf&src-supplier=Element14; ComponentLink6Description: http://www.ti.com/general/docs/lit/getliterature.tsp?genericPartNumber=TPS3702&&fileType=pdf&src-supplier=Element14; Supplier Part Number 1: 296-39651-6-ND
U13 = SUPERVISOR_1V2_TPS3702CX12DDCT_TSOT: Processor Supervisor 1.2V 1 Active Low/Open Drain 6-Pin TSOT-23 T/R; Manufacturer: Texas Instruments; Number of Voltages Monitored: 1; Min Supply Voltage: 2V; Max Supply Voltage: 18V; Quiescent Current: 6uA; Supplier 1: Digi-Key; Manufacturer Part Number: TPS3702CX12DDCT; RoHS: Yes; Category: Voltage Supervisors; Stock 1: 513; Pricing 1: 1=2.89000, 10=2.59800, 25=2.45640, 100=2.12900 (USD); Mount: Surface Mount; Case/Package: SOT-23-6; Number of Pins: 6; Min Operating Temperature: -40°C; Max Operating Temperature: 125°C; Packaging: Cut Tape; Reset: Active Low; Threshold Voltage: 1.2V; Type: Voltage Detector; REACH SVHC: No SVHC; Lead Free: Lead Free; RoHS Compliant: Yes; ComponentLink1URL: http://www.ti.com/general/docs/lit/getliterature.tsp?genericPartNumber=TPS3702&&fileType=pdf&src-supplier=Farnell; ComponentLink1Description: http://www.ti.com/general/docs/lit/getliterature.tsp?genericPartNumber=TPS3702&&fileType=pdf&src-supplier=Farnell; ComponentLink2URL: http://www.ti.com/lit/ds/symlink/tps3702.pdf?src-supplier=Digi-Key; ComponentLink2Description: http://www.ti.com/lit/ds/symlink/tps3702.pdf?src-supplier=Digi-Key; ComponentLink3URL: http://www.ti.com/general/docs/lit/getliterature.tsp?genericPartNumber=TPS3702&&fileType=pdf&src-supplier=Avnet; ComponentLink3Description: http://www.ti.com/general/docs/lit/getliterature.tsp?genericPartNumber=TPS3702&&fileType=pdf&src-supplier=Avnet; ComponentLink4URL: http://www.ti.com/general/docs/lit/getliterature.tsp?genericPartNumber=TPS3702&&fileType=pdf&src-supplier=Element14; ComponentLink4Description: http://www.ti.com/general/docs/lit/getliterature.tsp?genericPartNumber=TPS3702&&fileType=pdf&src-supplier=Element14; Supplier Part Number 1: 296-42074-1-ND
Y1 = 25MHz_XTAL_ECS-2520S33-250-FN-TR: Oscillator XO 25MHz ±10ppm 15pF HCMOS 55% 3.3V 4-Pin Mini-CSMD T/R; Manufacturer: ECS International; Max Supply Current: 7mA; Supplier 1: Digi-Key; Manufacturer Part Number: ECS-2520S33-250-FN-TR; RoHS: Yes; Category: Oscillators; Pricing 1: 1=2,35000, 10=2,24700, 50=2,19440, 100=1,88100, 500=1,82876 (USD); Mount: Surface Mount; Case/Package: SMD/SMT; Min Operating Temperature: -40°C; Max Operating Temperature: 85°C; Packaging: Tape and Reel; Frequency: 25MHz; Frequency Stability: 10ppm; RoHS Compliant: Yes; ComponentLink1URL: https://www.ecsxtal.com/store/pdf/ECS-2520S.pdf?src-supplier=Digi-Key; ComponentLink1Description: https://www.ecsxtal.com/store/pdf/ECS-2520S.pdf?src-supplier=Digi-Key; Supplier Part Number 1: XC2198DKR-ND